# EAGLE design scorpion_shield_mega (EAGLE 6.5.0)
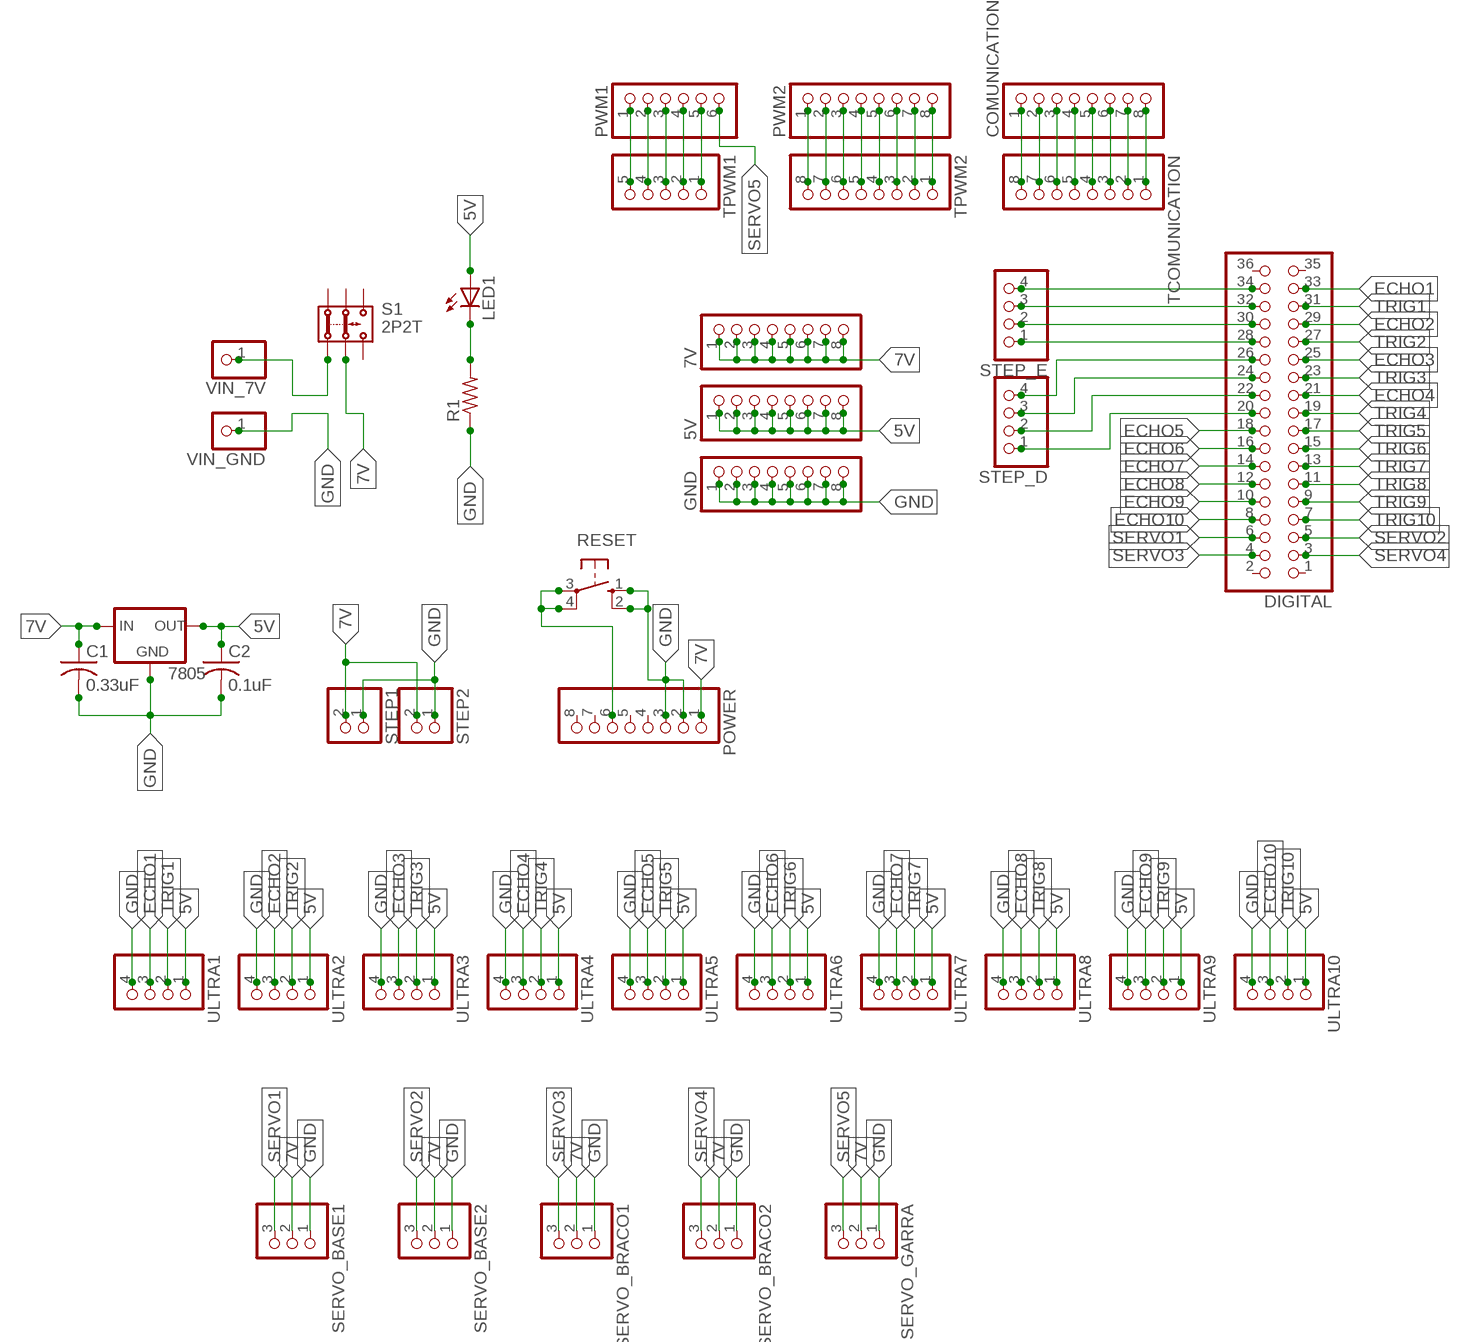
[diagram p0: schematic, sheet 1]

## Parts
5V  PINHD-1X8  [1X08]
7V  PINHD-1X8  [1X08]
7805  78XXS  [78XXS]
C1  0.33uF  C-US050-025X075  [C050-025X075]
C2  0.1uF  C-US050-025X075  [C050-025X075]
COMUNICATION  PINHD-1X8  [1X08]
DIGITAL  PINHD-2X18  [2X18]
GND  PINHD-1X8  [1X08]
LED1  LED5MM  [LED5MM]
POWER  PINHD-1X8  [1X08]
PWM1  PINHD-1X6  [1X06]
PWM2  PINHD-1X8  [1X08]
R1  R-US_0204/7  [0204/7]
RESET  10-XX  [B3F-10XX]
S1  2P2T  [2P2T]
SERVO_BASE1  PINHD-1X3  [1X03]
SERVO_BASE2  PINHD-1X3  [1X03]
SERVO_BRACO1  PINHD-1X3  [1X03]
SERVO_BRACO2  PINHD-1X3  [1X03]
SERVO_GARRA  PINHD-1X3  [1X03]
STEP1  PINHD-1X2  [1X02]
STEP2  PINHD-1X2  [1X02]
STEP_D  PINHD-1X4  [1X04]
STEP_E  PINHD-1X4  [1X04]
TCOMUNICATION  PINHD-1X8  [1X08]
TPWM1  PINHD-1X5  [1X05]
TPWM2  PINHD-1X8  [1X08]
ULTRA1  PINHD-1X4  [1X04]
ULTRA2  PINHD-1X4  [1X04]
ULTRA3  PINHD-1X4  [1X04]
ULTRA4  PINHD-1X4  [1X04]
ULTRA5  PINHD-1X4  [1X04]
ULTRA6  PINHD-1X4  [1X04]
ULTRA7  PINHD-1X4  [1X04]
ULTRA8  PINHD-1X4  [1X04]
ULTRA9  PINHD-1X4  [1X04]
ULTRA10  PINHD-1X4  [1X04]
VIN_7V  PINHD-1X1  [1X01]
VIN_GND  PINHD-1X1  [1X01]

## Nets
5V: 5V.1 5V.2 5V.3 5V.4 5V.5 5V.6 5V.7 5V.8 7805.OUT C2.1 LED1.A ULTRA1.1 ULTRA2.1 ULTRA3.1 ULTRA4.1 ULTRA5.1 ULTRA6.1 ULTRA7.1 ULTRA8.1 ULTRA9.1 ULTRA10.1
7V: 7V.1 7V.2 7V.3 7V.4 7V.5 7V.6 7V.7 7V.8 7805.IN C1.1 POWER.1 S1.2.2 SERVO_BASE1.2 SERVO_BASE2.2 SERVO_BRACO1.2 SERVO_BRACO2.2 SERVO_GARRA.2 STEP1.2 STEP2.2
ECHO1: DIGITAL.33 ULTRA1.3
ECHO2: DIGITAL.29 ULTRA2.3
ECHO3: DIGITAL.25 ULTRA3.3
ECHO4: DIGITAL.21 ULTRA4.3
ECHO5: DIGITAL.18 ULTRA5.3
ECHO6: DIGITAL.16 ULTRA6.3
ECHO7: DIGITAL.14 ULTRA7.3
ECHO8: DIGITAL.12 ULTRA8.3
ECHO9: DIGITAL.10 ULTRA9.3
ECHO10: DIGITAL.8 ULTRA10.3
GND: 7805.GND C1.2 C2.2 GND.1 GND.2 GND.3 GND.4 GND.5 GND.6 GND.7 GND.8 POWER.2 POWER.3 R1.1 RESET.1(S) RESET.2(S1) SERVO_BASE1.1 SERVO_BASE2.1 SERVO_BRACO1.1 SERVO_BRACO2.1 SERVO_GARRA.1 STEP1.1 STEP2.1 ULTRA1.4 ULTRA2.4 ULTRA3.4 ULTRA4.4 ULTRA5.4 ULTRA6.4 ULTRA7.4 ULTRA8.4 ULTRA9.4 ULTRA10.4 VIN_GND.1
N$1: DIGITAL.34 STEP_E.4
N$2: POWER.6 RESET.3(P) RESET.4(P1)
N$3: DIGITAL.32 STEP_E.3
N$4: DIGITAL.30 STEP_E.2
N$5: DIGITAL.28 STEP_E.1
N$6: DIGITAL.26 STEP_D.4
N$7: DIGITAL.24 STEP_D.3
N$8: DIGITAL.22 STEP_D.2
N$9: DIGITAL.20 STEP_D.1
N$26: S1.1.2 VIN_7V.1
N$27: LED1.K(C) R1.2
N$28: PWM2.1 TPWM2.8
N$29: PWM2.2 TPWM2.7
N$30: PWM2.3 TPWM2.6
N$31: PWM2.4 TPWM2.5
N$32: PWM2.5 TPWM2.4
N$33: PWM2.6 TPWM2.3
N$34: PWM2.7 TPWM2.2
N$35: PWM2.8 TPWM2.1
N$36: COMUNICATION.1 TCOMUNICATION.8
N$37: COMUNICATION.2 TCOMUNICATION.7
N$38: COMUNICATION.3 TCOMUNICATION.6
N$39: COMUNICATION.4 TCOMUNICATION.5
N$40: COMUNICATION.5 TCOMUNICATION.4
N$41: COMUNICATION.6 TCOMUNICATION.3
N$42: COMUNICATION.7 TCOMUNICATION.2
N$43: COMUNICATION.8 TCOMUNICATION.1
N$44: PWM1.1 TPWM1.5
N$45: PWM1.2 TPWM1.4
N$46: PWM1.3 TPWM1.3
N$47: PWM1.4 TPWM1.2
N$48: PWM1.5 TPWM1.1
SERVO1: DIGITAL.6 SERVO_BASE1.3
SERVO2: DIGITAL.5 SERVO_BASE2.3
SERVO3: DIGITAL.4 SERVO_BRACO1.3
SERVO4: DIGITAL.3 SERVO_BRACO2.3
SERVO5: PWM1.6 SERVO_GARRA.3
TRIG1: DIGITAL.31 ULTRA1.2
TRIG2: DIGITAL.27 ULTRA2.2
TRIG3: DIGITAL.23 ULTRA3.2
TRIG4: DIGITAL.19 ULTRA4.2
TRIG5: DIGITAL.17 ULTRA5.2
TRIG6: DIGITAL.15 ULTRA6.2
TRIG7: DIGITAL.13 ULTRA7.2
TRIG8: DIGITAL.11 ULTRA8.2
TRIG9: DIGITAL.9 ULTRA9.2
TRIG10: DIGITAL.7 ULTRA10.2
Unconnected: DIGITAL.1 DIGITAL.2 DIGITAL.35 DIGITAL.36 POWER.4 POWER.5 POWER.7 POWER.8 S1.1.1 S1.2.1 S1.3.1 S1.3.2

## Library data of the parts
5V 7V COMUNICATION GND POWER PWM2 TCOMUNICATION TPWM2 = pinhead:PINHD-1X8: PIN HEADER
7805 = v-reg:78XXS: VOLTAGE REGULATOR
C1 C2 = rcl:C-US: CAPACITOR, American symbol
DIGITAL = pinhead:PINHD-2X18: PIN HEADER
LED1 = led:LED: LED OSRAM: - CHIPLED LG R971, LG N971, LY N971, LG Q971, LY Q971, LO R971, LY R971 LH N974, LH R974 LS Q976, LO Q976, LY Q976 LO Q996 - Hyper CHIPLED LW Q18S LB Q993, LB Q99A, LB R99A - SideLED LS A670, LO A670, LY A670, LG A670, LP A670 LB A673, LV A673, LT A673, LW A673 LH A674 LY A675 LS A676, LA A676, LO A676, LY A676, LW A676 LS A679, LY A679, LG A679 - Hyper Micro SIDELED® LS Y876, LA Y876, LO Y876, LY Y876 LT Y87S - SmartLED LW L88C, LW L88S LB L89C, LB L89S, LG L890 LS L89K, LO L89K, LY L89K LS L896, LA L896, LO L896, LY L896 - TOPLED LS T670, LO T670, LY T670, LG T670, LP T670 LSG T670, LSP T670, LSY T670, LOP T670, LYG T670 LG T671, LOG T671, LSG T671 LB T673, LV T673, LT T673, LW T673 LH T674 LS T676, LA T676, LO T676, LY T676, LB T676, LH T676, LSB T676, LW T676 LB T67C, LV T67C, LT T67C, LS T67K, LO T67K, LY T67K, LW E67C LS E67B, LA E67B, LO E67B, LY E67B, LB E67C, LV E67C, LT E67C LW T67C LS T679, LY T679, LG T679 LS T770, LO T770, LY T770, LG T770, LP T770 LB T773, LV T773, LT T773, LW T773 LH T774 LS E675, LA E675, LY E675, LS T675 LS T776, LA T776, LO T776, LY T776, LB T776 LHGB T686 LT T68C, LB T68C - Hyper Mini TOPLED® LB M676 - Mini TOPLED Santana® LG M470 LS M47K, LO M47K, LY M47K Source: http://www.osram.convergy.de LUXEON: - LUMILED® LXK2-PW12-R00, LXK2-PW12-S00, LXK2-PW14-U00, LXK2-PW14-V00 LXK2-PM12-R00, LXK2-PM12-S00, LXK2-PM14-U00 LXK2-PE12-Q00, LXK2-PE12-R00, LXK2-PE12-S00, LXK2-PE14-T00, LXK2-PE14-U00 LXK2-PB12-K00, LXK2-PB12-L00, LXK2-PB12-M00, LXK2-PB14-N00, LXK2-PB14-P00, LXK2-PB14-Q00 LXK2-PR12-L00, LXK2-PR12-M00, LXK2-PR14-Q00, LXK2-PR14-R00 LXK2-PD12-Q00, LXK2-PD12-R00, LXK2-PD12-S00 LXK2-PH12-R00, LXK2-PH12-S00 LXK2-PL12-P00, LXK2-PL12-Q00, LXK2-PL12-R00 Source: www.luxeon.com KINGBRIGHT: KA-3528ASYC Source: www.kingbright.com
PWM1 = pinhead:PINHD-1X6: PIN HEADER
R1 = rcl:R-US_: RESISTOR, American symbol
RESET = switch-omron:10-XX: OMRON SWITCH; MPN: B3F-1000; OC_FARNELL: 176432; OC_NEWARK: 36M3542
S1 = switch:2P2T: SLIDE SWITCH 2P2T Part No. SS-22F05-G(A)4 Source: CANAL ELECTRONIC CO., LTD .. switsch.pdf
SERVO_BASE1 SERVO_BASE2 SERVO_BRACO1 SERVO_BRACO2 SERVO_GARRA = pinhead:PINHD-1X3: PIN HEADER
STEP1 STEP2 = pinhead:PINHD-1X2: PIN HEADER
STEP_D STEP_E ULTRA1-ULTRA10 = pinhead:PINHD-1X4: PIN HEADER
TPWM1 = pinhead:PINHD-1X5: PIN HEADER
VIN_7V VIN_GND = pinhead:PINHD-1X1: PIN HEADER

## Board
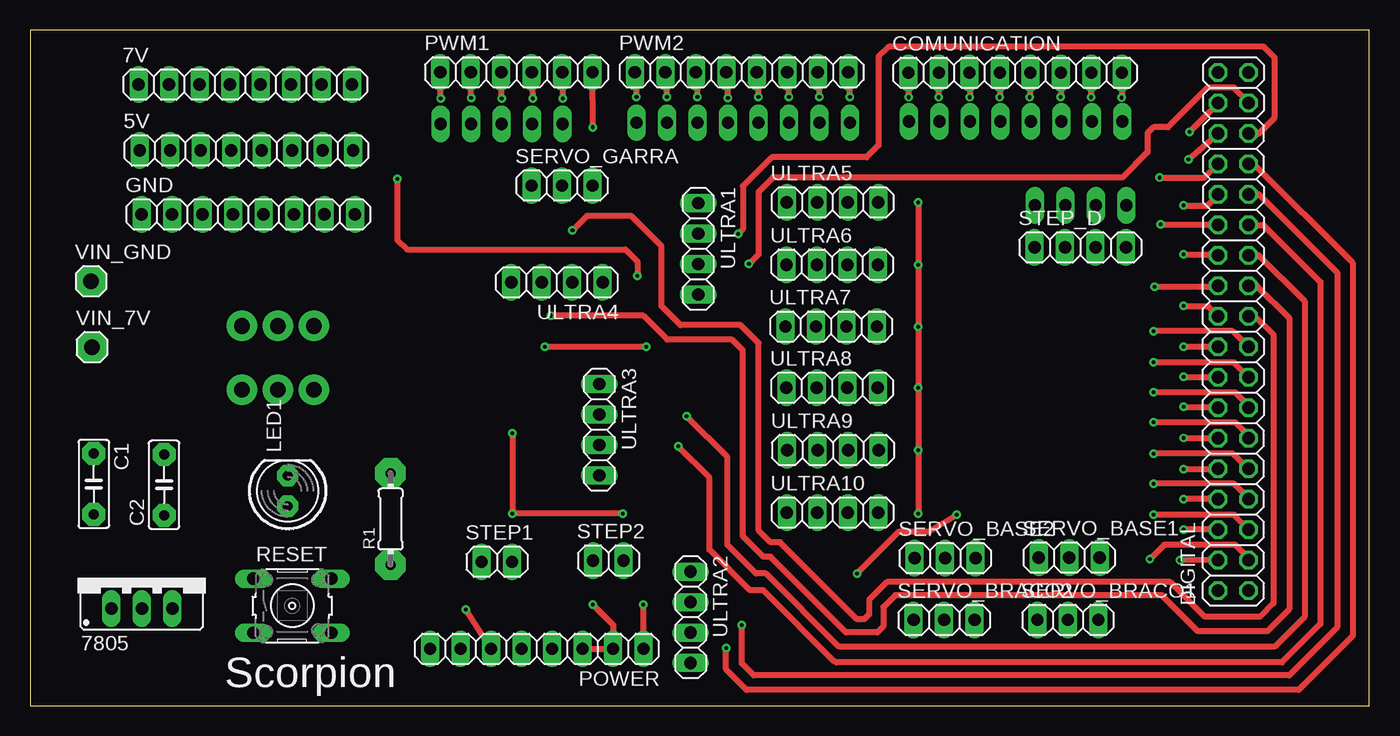
[diagram p1: board, top side]
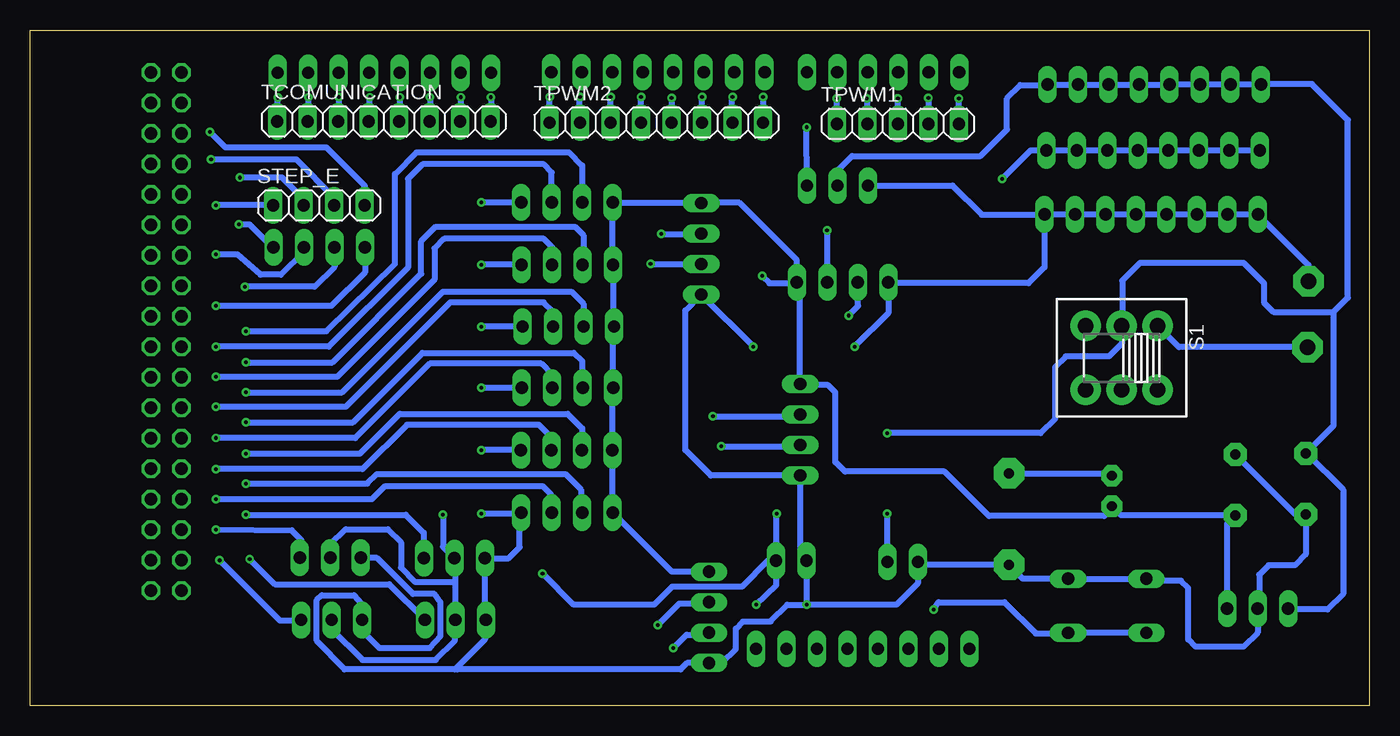
[diagram p2: board, bottom side, seen from below]

Size 111.6 x 56.3 mm. Coordinates in mm from the lower left corner, seen from the top.
Outline: 0,0 111.6,0 111.6,56.3 0,56.3 0,0
Copper layers (1*16): Top 0.035mm / dielectric 1.5mm / Bottom 0.035mm
Design rules "default": minimum track width 10mil, minimum drill 24mil, track to track 8mil, track to pad 8mil, pad to pad 8mil, via to via 8mil, smd to smd 8mil, copper to edge 40mil, drill to drill 8mil, minimum pad ring 10mil, minimum via ring 8mil, stop-mask expansion 4mil, vias tented up to drill 0mil, thermal gap 10mil

### Footprints (pad centres in the part's own frame; a part is rotated, then mirrored left to right if it is on the bottom)
1X08 = drill 1.016 long: 1 -8.89,0; 2 -6.35,0; 3 -3.81,0; 4 -1.27,0; 5 1.27,0; 6 3.81,0; 7 6.35,0; 8 8.89,0
78XXS = drill 1.016 long: GND 0,-2.54; IN -2.54,-2.54; OUT 2.54,-2.54
C050-025X075 = drill 0.813 pad 1.93 octagon: 1 -2.54,0; 2 2.54,0
2X18 = drill 1.016 octagon: 1 -21.59,-1.27; 2 -21.59,1.27; 3 -19.05,-1.27; 4 -19.05,1.27; 5 -16.51,-1.27; 6 -16.51,1.27; 7 -13.97,-1.27; 8 -13.97,1.27; 9 -11.43,-1.27; 10 -11.43,1.27; 11 -8.89,-1.27; 12 -8.89,1.27; 13 -6.35,-1.27; 14 -6.35,1.27; 15 -3.81,-1.27; 16 -3.81,1.27; 17 -1.27,-1.27; 18 -1.27,1.27; 19 1.27,-1.27; 20 1.27,1.27; 21 3.81,-1.27; 22 3.81,1.27; 23 6.35,-1.27; 24 6.35,1.27; 25 8.89,-1.27; 26 8.89,1.27; 27 11.43,-1.27; 28 11.43,1.27; 29 13.97,-1.27; 30 13.97,1.27; 31 16.51,-1.27; 32 16.51,1.27; 33 19.05,-1.27; 34 19.05,1.27; 35 21.59,-1.27; 36 21.59,1.27
LED5MM = drill 0.813 pad 1.778 octagon: A -1.27,0; K 1.27,0
1X06 = drill 1.016 long: 1 -6.35,0; 2 -3.81,0; 3 -1.27,0; 4 1.27,0; 5 3.81,0; 6 6.35,0
0204/7 = drill 0.813 pad 2.54 octagon: 1 -3.81,0; 2 3.81,0
B3F-10XX = drill 1.016 long: 1 -3.251,2.261; 2 3.251,2.261; 3 -3.251,-2.261; 4 3.251,-2.261
2P2T = drill 1.3 pad 2.54: 1.1 -3,2.65; 1.2 -3,-2.65; 2.1 0,2.65; 2.2 0,-2.65; 3.1 3,2.65; 3.2 3,-2.65
1X03 = drill 1.016 long: 1 -2.54,0; 2 0,0; 3 2.54,0
1X02 = drill 1.016 long: 1 -1.27,0; 2 1.27,0
1X04 = drill 1.016 long: 1 -3.81,0; 2 -1.27,0; 3 1.27,0; 4 3.81,0
1X05 = drill 1.016 long: 1 -5.08,0; 2 -2.54,0; 3 0,0; 4 2.54,0; 5 5.08,0
1X01 = drill 1.27 pad 2.54 octagon: 1 0,0

### Placement (x,y rotation side)
5V  18.02,46.26 0 top
7V  17.93,51.76 0 top
7805  9.32,10.62 0 top
C1  5.31,18.47 270 top
C2  11.17,18.39 90 top
COMUNICATION  82.07,52.73 0 top
DIGITAL  100.26,31.17 90 top
GND  18.18,40.93 0 top
LED1  21.47,17.89 90 top
POWER  42.23,4.72 180 top
PWM1  40.53,52.78 0 top
PWM2  59.28,52.78 0 top
R1  30.04,15.54 90 top
RESET  21.85,8.31 0 top
S1  20.65,28.98 180 bottom
SERVO_BASE1  86.58,12.33 0 top
SERVO_BASE2  76.24,12.28 0 top
SERVO_BRACO1  86.47,7.13 0 top
SERVO_BRACO2  76.16,7.13 0 top
SERVO_GARRA  44.32,43.33 0 top
STEP1  38.9,11.98 0 top
STEP2  48.18,12.08 0 top
STEP_D  87.51,38.18 0 top
STEP_E  87.52,41.68 0 bottom
TCOMUNICATION  82.13,48.68 0 bottom
TPWM1  39.29,48.48 0 bottom
TPWM2  59.42,48.58 0 bottom
ULTRA1  55.68,38.05 270 top
ULTRA2  55.03,7.35 270 top
ULTRA3  47.43,22.98 270 top
ULTRA4  43.91,35.27 180 top
ULTRA5  66.86,41.93 0 top
ULTRA6  66.83,36.73 0 top
ULTRA7  66.75,31.58 0 top
ULTRA8  66.82,26.48 0 top
ULTRA9  66.89,21.28 0 top
ULTRA10  66.86,16.08 0 top
VIN_7V  5.16,29.86 0 top
VIN_GND  5.08,35.36 0 top

### Tracks (layer width: path | path; a pad name or v marks a point on that pad's centre or on a via)
5V  (via drill 0.3)
  Top 0.5: v30.6,43.9 30.6,38.8 31.4,38 49.6,38 50.6,37 v50.6,35.8
  Bottom 0.5: 7805.OUT 11.86,15.16 C2.1 20.7,15.85 LED1.A 21.47,16.43 22.1,15.8 31.7,15.8 35.4,19.5 43.7,19.5 44.5,20.3 44.5,26.1 45.1,26.7 47.34,26.7 ULTRA3.1 47.43,34.98 ULTRA4.1 | 5V.1 5V.2 5V.3 5V.4 5V.5 5V.6 5V.7 5V.8 28.24,46.26 v30.6,43.9 | ULTRA4.1 47.72,37.12 52.5,41.9 55.64,41.9 ULTRA1.1 62.98,41.86 ULTRA5.1 63.05,36.76 ULTRA6.1 63.04,36.65 63.04,31.68 ULTRA7.1 63.01,31.51 ULTRA8.1 63.08,26.41 ULTRA9.1 63.05,21.25 ULTRA10.1 58.13,11.16 ULTRA2.1 | v50.6,35.8 50,35.2 47.79,35.2 ULTRA4.1
7V  (via drill 0.3)
  Top 0.5: POWER.1 v51.1,8.4 | v68.9,11 72.4,14.5 74.9,14.5 v77.2,15.9 | v40.2,22.7 v40.2,16 v49.4,16
  Bottom 0.5: SERVO_BRACO1.2 86.47,6.37 83.9,3.8 77.8,3.8 76.2,5.4 76.2,7.09 SERVO_BRACO2.2 76.16,10.3 | 76.16,10.3 76.16,12.2 SERVO_BASE2.2 77.2,13.24 v77.2,15.9 | SERVO_BASE1.2 86.58,13.42 85.3,14.7 81.8,14.7 80.7,13.6 80.7,11.5 79.5,10.3 76.16,10.3 | 3,32.8 8,32.8 8.8,33.6 8.8,35.2 10.5,36.9 19.1,36.9 20.6,35.4 20.6,31.68 S1.2.2 20.65,30.15 21.7,29.1 25.3,29.1 26.2,28.2 26.2,23.9 27.4,22.7 v40.2,22.7 | 3,32.8 1.8,34 1.8,48.8 4.8,51.8 9,51.8 7V.1 7V.2 7V.3 7V.4 7V.5 7V.6 7V.7 7V.8 26.88,51.7 29.1,51.7 30.2,50.6 30.2,48 32.4,45.8 43.1,45.8 44.32,44.58 SERVO_GARRA.2 | 3,32.8 3,23.32 C1.1 5.21,21.01 2.2,18 2.2,9.3 3.5,8 6.7,8 7805.IN | v51.1,8.4 49.42,10.02 49.42,12.05 | 49.42,12.05 STEP2.2 50.12,12.08 52.3,9.9 58.1,9.9 59.6,8.4 66.3,8.4 v68.9,11 | v40.2,16 40.2,12.01 STEP1.2 | 49.42,12.05 49.42,15.98 v49.4,16
ECHO1  (via drill 0.3)
  Top 0.5: DIGITAL.33 101.53,50.27 100.3,51.5 98.1,51.5 94.8,48.2 93.6,48.2 93.1,47.7 93.1,46.1 91,44 61.9,44 60.7,42.8 60.7,37.6 v59.9,36.8
  Bottom 0.5: v59.9,36.8 55.7,36.8 ULTRA1.3
ECHO2  (via drill 0.3)
  Top 0.5: DIGITAL.29 101.96,45.14 110.2,36.9 110.2,5.8 105.7,1.3 59.7,1.3 58,3 v58,4.8
  Bottom 0.5: v58,4.8 56.9,5.9 55.21,5.9 ULTRA2.3
ECHO3  (via drill 0.3)
  Top 0.5: DIGITAL.25 102.74,40.06 107.5,35.3 107.5,6.8 104.3,3.6 67.2,3.6 67,3.7 61.1,9.6 60,9.6 56.6,13 56.6,19 v54,21.6
  Bottom 0.5: v54,21.6 47.54,21.6 ULTRA3.3
ECHO4  (via drill 0.3)
  Top 0.5: DIGITAL.21 102.22,34.98 104.9,32.3 104.9,8 103.1,6.2 97.3,6.2 94.3,9.2 72.1,9.2 71.1,8.2 71.1,6.6 70.6,6.1 68,6.1 61.7,12.4 61.1,12.4 59.4,14.1 59.4,29.6 58.5,30.5 53.1,30.5 51.1,32.5 v43.4,32.5
  Bottom 0.5: v43.4,32.5 42.6,33.3 42.6,35.23 ULTRA4.3
ECHO5  (via drill 0.3)
  Top 0.5: v96.1,29.9 DIGITAL.18
  Bottom 0.5: ULTRA5.3 68.13,44.43 68.8,45.1 78.9,45.1 80.1,43.9 80.1,36.5 86.7,29.9 v96.1,29.9
ECHO6  (via drill 0.3)
  Top 0.5: v96.1,27.4 98.95,27.4 DIGITAL.16
  Bottom 0.5: ULTRA6.3 68.1,38.2 68.8,38.9 77.1,38.9 77.9,38.1 77.9,35.5 86,27.4 v96.1,27.4
ECHO7  (via drill 0.3)
  Top 0.5: v96.1,24.9 98.91,24.9 DIGITAL.14
  Bottom 0.5: ULTRA7.3 68.02,32.82 68.8,33.6 76.6,33.6 85.3,24.9 v96.1,24.9
ECHO8  (via drill 0.3)
  Top 0.5: v96.1,22.3 98.97,22.3 DIGITAL.12
  Bottom 0.5: ULTRA8.3 68.09,27.59 69,28.5 78.3,28.5 84.5,22.3 v96.1,22.3
ECHO9  (via drill 0.3)
  Top 0.5: v96.1,19.7 98.75,19.7 DIGITAL.10
  Bottom 0.5: ULTRA9.3 68.16,22.36 69.2,23.4 80.2,23.4 83.9,19.7 v96.1,19.7
ECHO10  (via drill 0.3)
  Top 0.5: DIGITAL.8 v96.1,17.2
  Bottom 0.5: v96.1,17.2 83.1,17.2 82,18.3 68.9,18.3 68.2,17.6 68.2,16.15 ULTRA10.3
GND  (via drill 0.3)
  Top 0.5: v74,41.93 v74,36.73 v74,31.58 v74,26.48 v74,21.28 v74,16 | v46.9,8.4 48.6,6.7 48.6,4.72 POWER.2 POWER.3 | v42.9,29.9 v51.34,29.9
  Bottom 0.5: 70.75,16 70.8,15.95 70.8,13.2 71.72,12.28 SERVO_BASE2.1 73.7,7.13 | 70.75,16 ULTRA10.4 | ULTRA5.4 v74,41.93 | ULTRA9.4 v74,21.28 | ULTRA8.4 v74,26.48 | ULTRA7.4 v74,31.58 | ULTRA6.4 v74,36.73 | SERVO_BRACO2.1 73.7,7.13 | SERVO_BASE1.1 84.01,12.3 82.7,12.3 79.7,9.3 77.9,9.3 77.4,8.6 77.4,5.8 78.3,4.8 82.5,4.8 83.93,6.23 SERVO_BRACO1.1 84,7.2 84,8.5 84.6,9.2 87.3,9.2 87.7,8.8 87.7,5.4 85.4,3 76.2,3 76.1,3.1 | 73.7,7.13 73.7,5.5 76.1,3.1 | v74,16 70.75,16 | VIN_GND.1 5.08,36.72 GND.1 GND.2 GND.3 GND.4 GND.5 GND.6 GND.7 GND.8 | C2.2 6.17,15.93 C1.2 5.31,12.59 6.2,11.7 8.4,11.7 9.2,10.9 9.2,8.2 7805.GND 9.32,6.08 10.5,4.9 14.5,4.9 15.1,5.5 15.1,9.8 15.7,10.4 18.43,10.4 RESET.1 RESET.2 28.88,10.57 R1.1 37.38,11.73 STEP1.1 37.63,10.17 39.4,8.4 46.86,8.4 46.88,8.42 | 46.88,8.42 v46.9,8.4 48.5,8.4 49.9,7 52.2,7 52.8,6.4 52.8,4.7 53.96,3.54 ULTRA2.4 56.86,3.54 57.4,3 76,3 76.1,3.1 | 46.88,8.42 46.88,12.05 STEP2.1 47.43,12.6 ULTRA3.4 54.87,19.17 57,21.3 57,32.92 ULTRA1.4 v51.34,29.9 | GND.8 27.07,36.53 28.4,35.2 40.03,35.2 ULTRA4.4 40.1,32.7 v42.9,29.9 | SERVO_GARRA.1 34.73,43.33 32.3,40.9 27.1,40.9 GND.8
N$1  (via drill 0.3)
  Top 0.5: v96.6,47.8 DIGITAL.34
  Bottom 0.5: STEP_E.4 83.71,43.31 86.9,46.5 95.3,46.5 v96.6,47.8
N$2  (via drill 0.3)
  Top 0.5: POWER.6 v36.32,7.98
  Bottom 0.5: RESET.3 RESET.4 25.15,6 27.8,6 30.4,8.6 35.9,8.6 v36.32,7.98
N$3  (via drill 0.3)
  Top 0.5: v96.51,45.5 DIGITAL.32
  Bottom 0.5: STEP_E.3 86.25,42.35 89.4,45.5 v96.51,45.5
N$4  (via drill 0.3)
  Top 0.5: v94.1,44 97.85,44 DIGITAL.30
  Bottom 0.5: STEP_E.2 88.79,42.19 90.6,44 v94.1,44
N$5  (via drill 0.3)
  Top 0.5: v96.1,41.68 98.07,41.68 DIGITAL.28
  Bottom 0.5: STEP_E.1 91.3,41.7 96.1,41.7 96.12,41.68 v96.1,41.68
N$6  (via drill 0.3)
  Top 0.5: v94.2,40.1 98.95,40.1 DIGITAL.26
  Bottom 0.5: STEP_D.4 91.38,38.18 93.3,40.1 v94.2,40.1
N$7  (via drill 0.3)
  Top 0.5: v96.1,37.6 98.91,37.6 DIGITAL.24
  Bottom 0.5: STEP_D.3 88.78,37.82 90.7,35.9 92.4,35.9 94.3,37.6 v96.1,37.6
N$8  (via drill 0.3)
  Top 0.5: v93.7,34.9 98.47,34.9 DIGITAL.22
  Bottom 0.5: STEP_D.2 86.24,36.56 87.9,34.9 v93.7,34.9
N$9  (via drill 0.3)
  Top 0.5: v96.1,33.3 98.13,33.3 DIGITAL.20
  Bottom 0.5: STEP_D.1 83.7,36.1 86.5,33.3 v96.1,33.3
N$26
  Bottom 0.5: VIN_7V.1 15.88,29.86 S1.1.2
N$27
  Bottom 0.5: R1.2 21.66,19.35 LED1.K
N$28  (via drill 0.3)
  Top 0.5: v50.53,50.73 50.53,52.64 PWM2.1
  Bottom 0.5: TPWM2.8 50.5,50.7 v50.53,50.73
N$29  (via drill 0.3)
  Top 0.5: v53.07,50.73 53.07,52.64 PWM2.2
  Bottom 0.5: TPWM2.7 53.1,50.7 v53.07,50.73
N$30  (via drill 0.3)
  Top 0.5: v55.61,50.71 55.61,52.64 PWM2.3
  Bottom 0.5: TPWM2.6 v55.6,50.7 v55.61,50.71
N$31  (via drill 0.3)
  Top 0.5: v58.15,50.65 58.15,52.64 PWM2.4
  Bottom 0.5: TPWM2.5 58.1,50.7 v58.15,50.65
N$32  (via drill 0.3)
  Top 0.5: v60.69,50.71 60.69,52.64 PWM2.5
  Bottom 0.5: TPWM2.4 v60.7,50.7 v60.69,50.71
N$33  (via drill 0.3)
  Top 0.5: v63.23,50.73 63.2,52.5 63.23,52.64 PWM2.6
  Bottom 0.5: TPWM2.3 v63.23,50.73
N$34  (via drill 0.3)
  Top 0.5: v65.77,50.73 65.77,52.64 PWM2.7
  Bottom 0.5: TPWM2.2 65.8,50.7 v65.77,50.73
N$35  (via drill 0.3)
  Top 0.5: v68.31,50.71 68.31,52.64 PWM2.8
  Bottom 0.5: TPWM2.1 v68.3,50.7 v68.31,50.71
N$36  (via drill 0.3)
  Top 0.5: COMUNICATION.1 v73.2,50.7
  Bottom 0.5: v73.2,50.7 73.18,50.68 73.18,48.74 TCOMUNICATION.8
N$37  (via drill 0.3)
  Top 0.5: COMUNICATION.2 v75.7,50.7
  Bottom 0.5: v75.7,50.7 75.72,50.68 75.72,48.74 TCOMUNICATION.7
N$38  (via drill 0.3)
  Top 0.5: COMUNICATION.3 v78.3,50.7
  Bottom 0.5: v78.3,50.7 78.26,50.74 78.26,48.74 TCOMUNICATION.6
N$39  (via drill 0.3)
  Top 0.5: COMUNICATION.4 v80.8,50.7
  Bottom 0.5: v80.8,50.7 80.8,48.74 TCOMUNICATION.5
N$40  (via drill 0.3)
  Top 0.5: COMUNICATION.5 v83.3,50.7
  Bottom 0.5: v83.3,50.7 83.34,50.66 83.34,48.74 TCOMUNICATION.4
N$41  (via drill 0.3)
  Top 0.5: COMUNICATION.6 v85.88,50.72
  Bottom 0.5: v85.88,50.72 85.9,50.7 85.88,48.74 TCOMUNICATION.3
N$42  (via drill 0.3)
  Top 0.5: COMUNICATION.7 v88.4,50.7
  Bottom 0.5: v88.4,50.7 88.42,50.68 88.42,48.74 TCOMUNICATION.2
N$43  (via drill 0.3)
  Top 0.5: COMUNICATION.8 v90.96,50.66
  Bottom 0.5: v90.96,50.66 91,50.7 90.96,48.74 TCOMUNICATION.1
N$44  (via drill 0.3)
  Top 0.5: v34.21,50.61 34.21,52.75 PWM1.1
  Bottom 0.5: TPWM1.5 v34.2,50.6 v34.21,50.61
N$45  (via drill 0.3)
  Top 0.5: v36.75,50.65 36.75,52.75 PWM1.2
  Bottom 0.5: TPWM1.4 36.7,50.6 v36.75,50.65
N$46  (via drill 0.3)
  Top 0.5: v39.29,50.61 39.29,52.75 PWM1.3
  Bottom 0.5: TPWM1.3 v39.3,50.6 39.3,50.7 v39.29,50.61
N$47  (via drill 0.3)
  Top 0.5: v41.9,50.6 41.83,52.75 PWM1.4
  Bottom 0.5: TPWM1.2 41.83,50.63 v41.9,50.6
N$48  (via drill 0.3)
  Top 0.5: v44.4,50.6 44.37,52.75 PWM1.5
  Bottom 0.5: TPWM1.1 44.37,50.67 v44.4,50.6
SERVO1  (via drill 0.3)
  Top 0.5: DIGITAL.6 v96.1,14.66
  Bottom 0.5: v96.1,14.66 89.8,14.6 89,13.8 89,12.45 SERVO_BASE1.3
SERVO2  (via drill 0.3)
  Top 0.5: DIGITAL.5 100.3,15.9 v93.6,15.9
  Bottom 0.5: v93.6,15.9 80.3,15.9 78.8,14.4 78.8,12.3 SERVO_BASE2.3
SERVO3  (via drill 0.3 pad 0.25)
  Top 0.5: DIGITAL.4 v95.8,12.1
  Bottom 0.5: v95.8,12.1 95.8,12.12 95.82,12.12 90.8,7.1 89.04,7.1 SERVO_BRACO1.3
SERVO4  (via drill 0.3)
  Top 0.5: DIGITAL.3 101.53,12.27 100.4,13.4 94.5,13.4 v93.3,12.2
  Bottom 0.5: v93.3,12.2 91.2,10.1 81.67,10.1 SERVO_BRACO2.3
SERVO5  (via drill 0.3)
  Top 0.5: v46.9,48.2 46.86,52.76 PWM1.6
  Bottom 0.5: SERVO_GARRA.3 v46.9,48.2
TRIG1  (via drill 0.3)
  Top 0.5: DIGITAL.31 102.38,47.68 103.7,49 103.7,54 102.8,54.9 71.5,54.9 70.7,54.1 70.7,46.7 69.7,45.7 61.8,45.7 59.4,43.3 59.4,39.7 v59,39.3
  Bottom 0.5: v59,39.3 55.7,39.3 ULTRA1.2
TRIG2  (via drill 0.3)
  Top 0.5: DIGITAL.27 102.4,42.6 108.9,36.1 108.9,6.5 104.9,2.5 60.3,2.5 59.3,3.5 v59.3,6.7
  Bottom 0.5: v59.3,6.7 57.5,8.5 55.15,8.5 ULTRA2.2
TRIG3  (via drill 0.3)
  Top 0.5: DIGITAL.23 102.38,37.52 106.2,33.7 106.2,7.4 103.7,4.9 67.4,4.9 61.3,11 60.5,11 58.1,13.4 58.1,20.7 v54.7,24.1
  Bottom 0.5: v54.7,24.1 47.58,24.1 ULTRA3.2
TRIG4  (via drill 0.3)
  Top 0.5: DIGITAL.19 102.06,32.44 103.6,30.9 103.6,8.5 102.5,7.4 97.9,7.4 95,10.3 71.4,10.3 69.9,8.8 69.9,7.6 69.5,7.2 68.9,7.2 62.5,13.6 61.7,13.6 60.7,14.6 60.7,30.2 59.2,31.7 54.2,31.7 52.6,33.3 52.6,38.3 50.1,40.8 46.4,40.8 v45.2,39.6
  Bottom 0.5: v45.2,39.6 45.2,35.29 ULTRA4.2
TRIG5  (via drill 0.3)
  Top 0.5: DIGITAL.17 101.5,29.9 100.2,31.2 v93.6,31.2
  Bottom 0.5: v93.6,31.2 86.9,31.2 81.2,36.8 81.2,44.3 79.4,46.1 66.7,46.1 65.6,45 ULTRA5.2
TRIG6  (via drill 0.3)
  Top 0.5: DIGITAL.15 100.3,28.6 v93.6,28.6
  Bottom 0.5: v93.6,28.6 86.4,28.6 79,36 79,38.7 77.8,39.9 66.2,39.9 65.5,39.2 65.5,36.79 ULTRA6.2
TRIG7  (via drill 0.3)
  Top 0.5: DIGITAL.13 101.53,24.97 100.4,26.1 v93.6,26.1
  Bottom 0.5: v93.6,26.1 85.6,26.1 77.2,34.5 66.5,34.5 65.5,33.5 65.5,31.6 ULTRA7.2
TRIG8  (via drill 0.3)
  Top 0.5: DIGITAL.11 101.53,22.47 100.4,23.6 v93.6,23.6
  Bottom 0.5: v93.6,23.6 84.7,23.6 78.9,29.4 66.3,29.4 65.6,28.7 65.6,26.53 ULTRA8.2
TRIG9  (via drill 0.3)
  Top 0.5: DIGITAL.9 101.46,19.74 100.2,21 v93.6,21
  Bottom 0.5: v93.6,21 84.1,21 80.8,24.3 66.8,24.3 65.6,23.1 65.6,21.3 ULTRA9.2
TRIG10  (via drill 0.3)
  Top 0.5: DIGITAL.7 101.53,17.27 100.3,18.5 v93.6,18.5
  Bottom 0.5: v93.6,18.5 83.5,18.5 82.7,19.3 67,19.3 65.7,18 65.7,16.19 ULTRA10.2

### Text on the board
tNames: Scorpion